# Altium schematic sheet ISO A4_QS-Labs.SchDoc
size A4
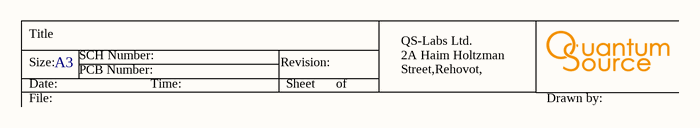
[diagram p0: ISO A4_QS-Labs.SchDoc]

## Notes on the sheet
- Title
- Size:
- Date:
- A3
- PCB Number:
- SCH Number:
- Time:
- Revision:
- Sheet
- of
- QS-Labs Ltd.
  2A Haim Holtzman Street,Rehovot, Israel
- File:
- Drawn by: